# Altium project STS.00.PrjPcb
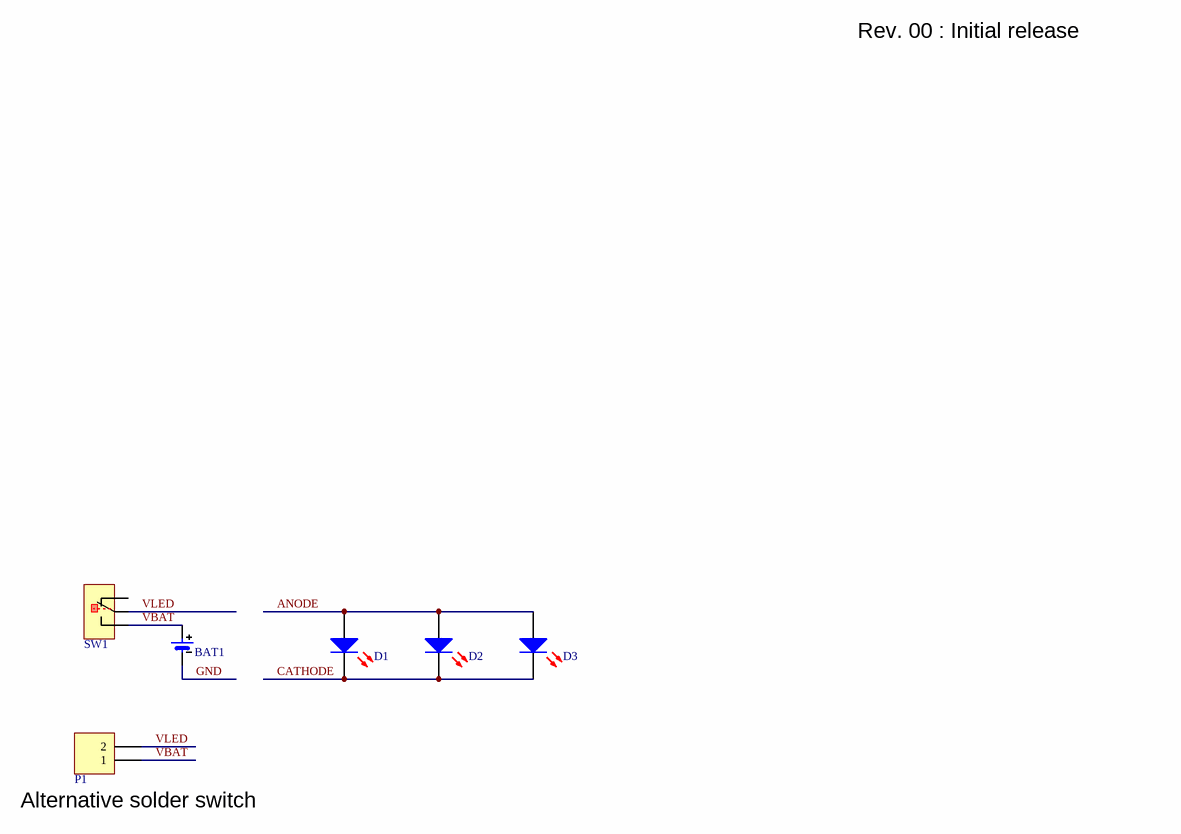
[diagram p0: STS.00.SchDoc]
PCB_ENGINEER: WimVG; PCB_REV: 00; PCB_TITLE: STS
1 sheet, 6 parts. Net scope: global (net labels, ports and power ports of the same name join across sheets).
Board files: STS_BASE.00.PcbDoc, STS_BODY.00.PcbDoc, STS_WINGS.00.PcbDoc, STS.00.PcbDoc

## Sheet STS.00.SchDoc: STS
size A3; Date: 21/01/2022; DrawnBy: Wim Van Gool; DocumentNumber: 1; Revision: 00; SheetNumber: 1; SheetTotal: 1

### Parts
BAT1  CR2032 SMD Battery Holder  [BAT_CR2032_KEY_1060]  (value not drawn)
D1  Default 5mm Red LED  [LED_5MM_RD]  (value not drawn)
D2  Default 5mm Red LED  [LED_5MM_RD]  (value not drawn)
D3  Default 5mm Red LED  [LED_5MM_RD]  (value not drawn)
P1  Easy to solder connection  [SOLDER_SW_V_1MM]  (value not drawn)
SW1  mini Switch 1 pole double throw right angle  [SK-12D07]  (value not drawn)

### Nets
ANODE: D1.1(A) D2.1(A) D3.1(A)
CATHODE: D1.2(K) D2.2(K) D3.2(K)
GND: BAT1.2
VBAT: BAT1.1 P1.1 SW1.3
VLED: P1.2 SW1.2

Not connected (* = marked no-connect by the designer): SW1 1

### Notes on the sheet
- Rev. 00 : Initial release
- (near P1) Alternative solder switch
- Title
- Revision
- Date
- Dranw By
- Size
- A3
- Sheet
- of

### Library data of the parts
BAT1 = BAT # 20mm Coin Cell Holder Keystone 1060: =Description; Value: CR2032; Supplier 1: Digi-key; Supplier Part Number 1: 36-1060-ND; Supplier 2: Aliexpress
D1-D3 = LED Red 5mm: =Description; Supplier 1: Farnell; Supplier Part Number 1: 2335725
P1 = SOLDER SW V 1MM: Value: NO BOM
SW1 = SW 1P2T micro RA SK-12D07: Description: SW 1P2T micro RA SK-12D07; Value: SK-12D07; Supplier 1: AliExpress; Supplier Part Number 1: SK-12D07

## Assembly variants
Default: all parts fitted